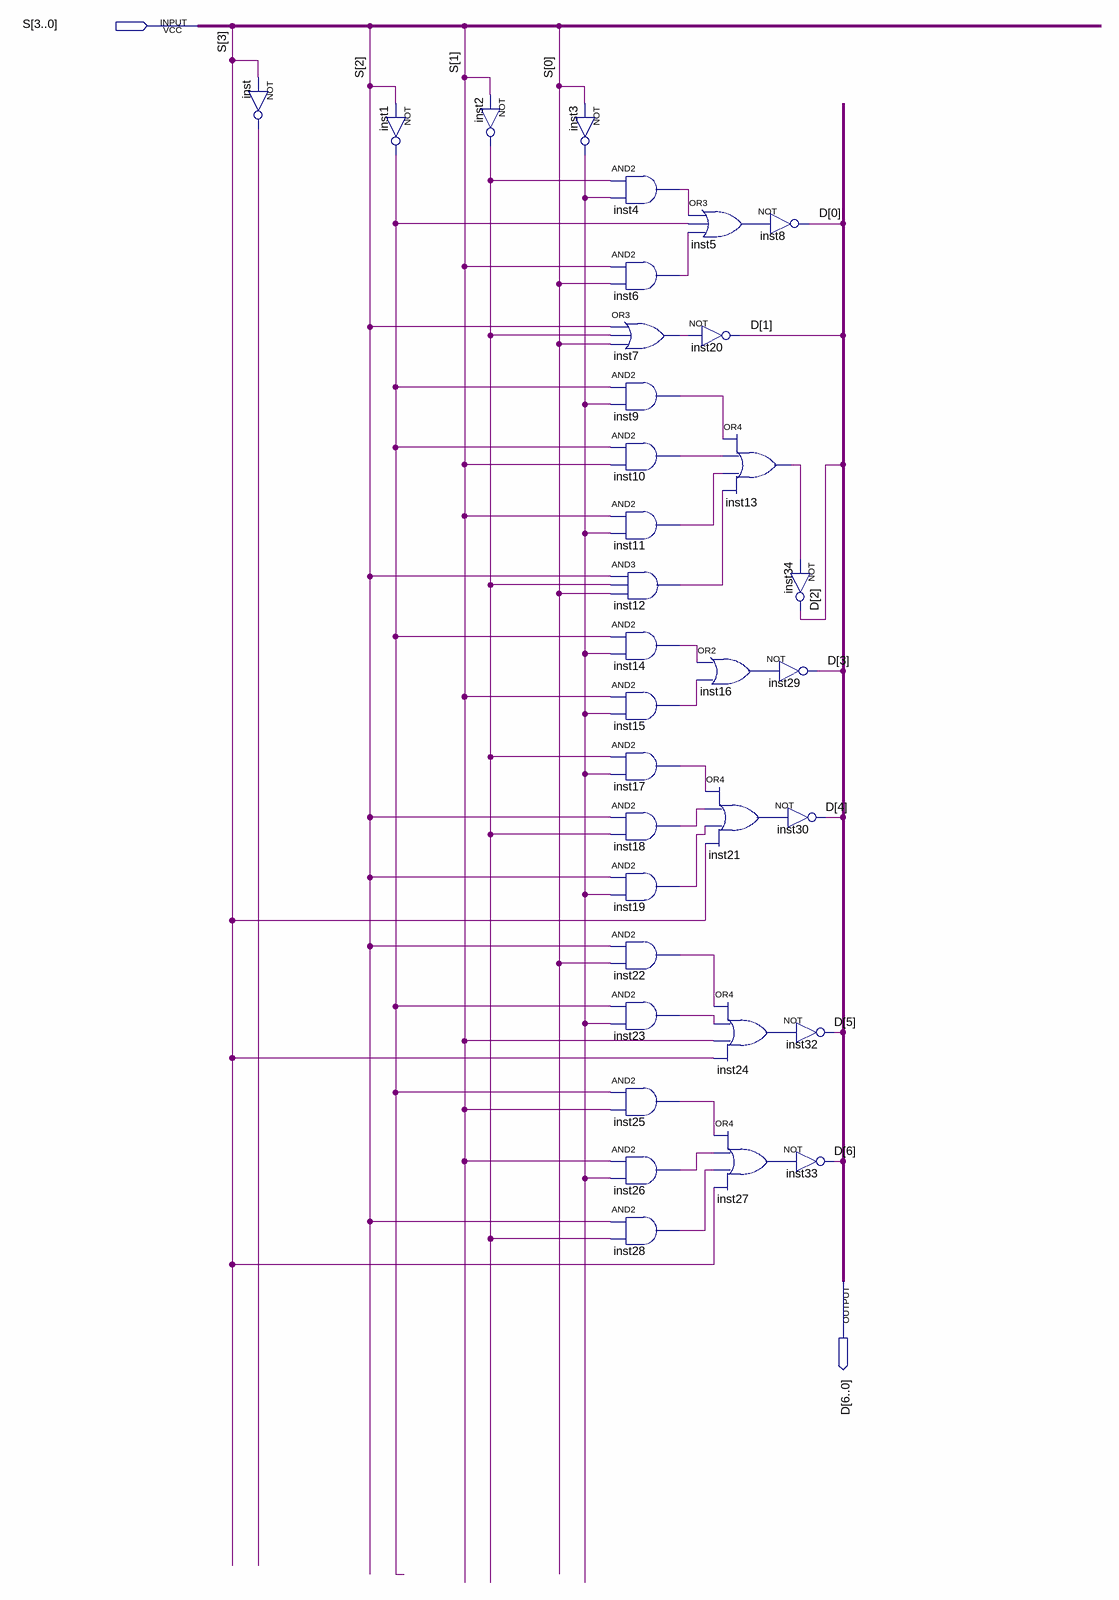
[diagram p0: schematic sheet]
// Quartus schematic DisplayBCD.bdf as structural Verilog: 34 symbols, 2 pins
module DisplayBCD (
  input  [3:0] S,
  output [6:0] D
);

  wire inst1_out, inst2_out, inst3_out, inst4_out, inst5_out, inst6_out, inst7_out, inst9_out, inst10_out,
       inst11_out, inst12_out, inst13_out, inst14_out, inst15_out, inst16_out, inst17_out, inst18_out,
       inst19_out, inst21_out, inst22_out, inst23_out, inst24_out, inst25_out, inst26_out, inst27_out,
       inst28_out, inst_out;

  not inst (inst_out, S[3]);
  not inst1 (inst1_out, S[2]);
  not inst2 (inst2_out, S[1]);
  not inst3 (inst3_out, S[0]);
  and inst4 (inst4_out, inst2_out, inst3_out);
  and inst6 (inst6_out, S[1], S[0]);
  or inst7 (inst7_out, S[2], inst2_out, S[0]);
  and inst9 (inst9_out, inst1_out, inst3_out);
  and inst10 (inst10_out, inst1_out, S[1]);
  and inst11 (inst11_out, S[1], inst3_out);
  and inst12 (inst12_out, S[2], inst2_out, S[0]);
  and inst14 (inst14_out, inst1_out, inst3_out);
  and inst15 (inst15_out, S[1], inst3_out);
  and inst17 (inst17_out, inst2_out, inst3_out);
  and inst18 (inst18_out, S[2], inst2_out);
  and inst19 (inst19_out, S[2], inst3_out);
  and inst22 (inst22_out, S[2], S[0]);
  and inst23 (inst23_out, inst1_out, inst3_out);
  and inst25 (inst25_out, inst1_out, S[1]);
  and inst26 (inst26_out, S[1], inst3_out);
  and inst28 (inst28_out, S[2], inst2_out);
  or inst5 (inst5_out, inst4_out, inst1_out, inst6_out);
  not inst20 (D[1], inst7_out);
  or inst16 (inst16_out, inst14_out, inst15_out);
  or inst21 (inst21_out, inst17_out, inst18_out, inst19_out, S[3]);
  or inst24 (inst24_out, inst22_out, inst23_out, S[1], S[3]);
  or inst27 (inst27_out, inst25_out, inst26_out, inst28_out, S[3]);
  not inst8 (D[0], inst5_out);
  or inst13 (inst13_out, inst9_out, inst10_out, inst11_out, inst12_out);
  not inst34 (D[2], inst13_out);
  not inst29 (D[3], inst16_out);
  not inst30 (D[4], inst21_out);
  not inst32 (D[5], inst24_out);
  not inst33 (D[6], inst27_out);
endmodule
